# Altium schematic sheet rf_clocks.SchDoc: RF & clocks
size A4; SheetNumber: 11; SheetTotal: 11
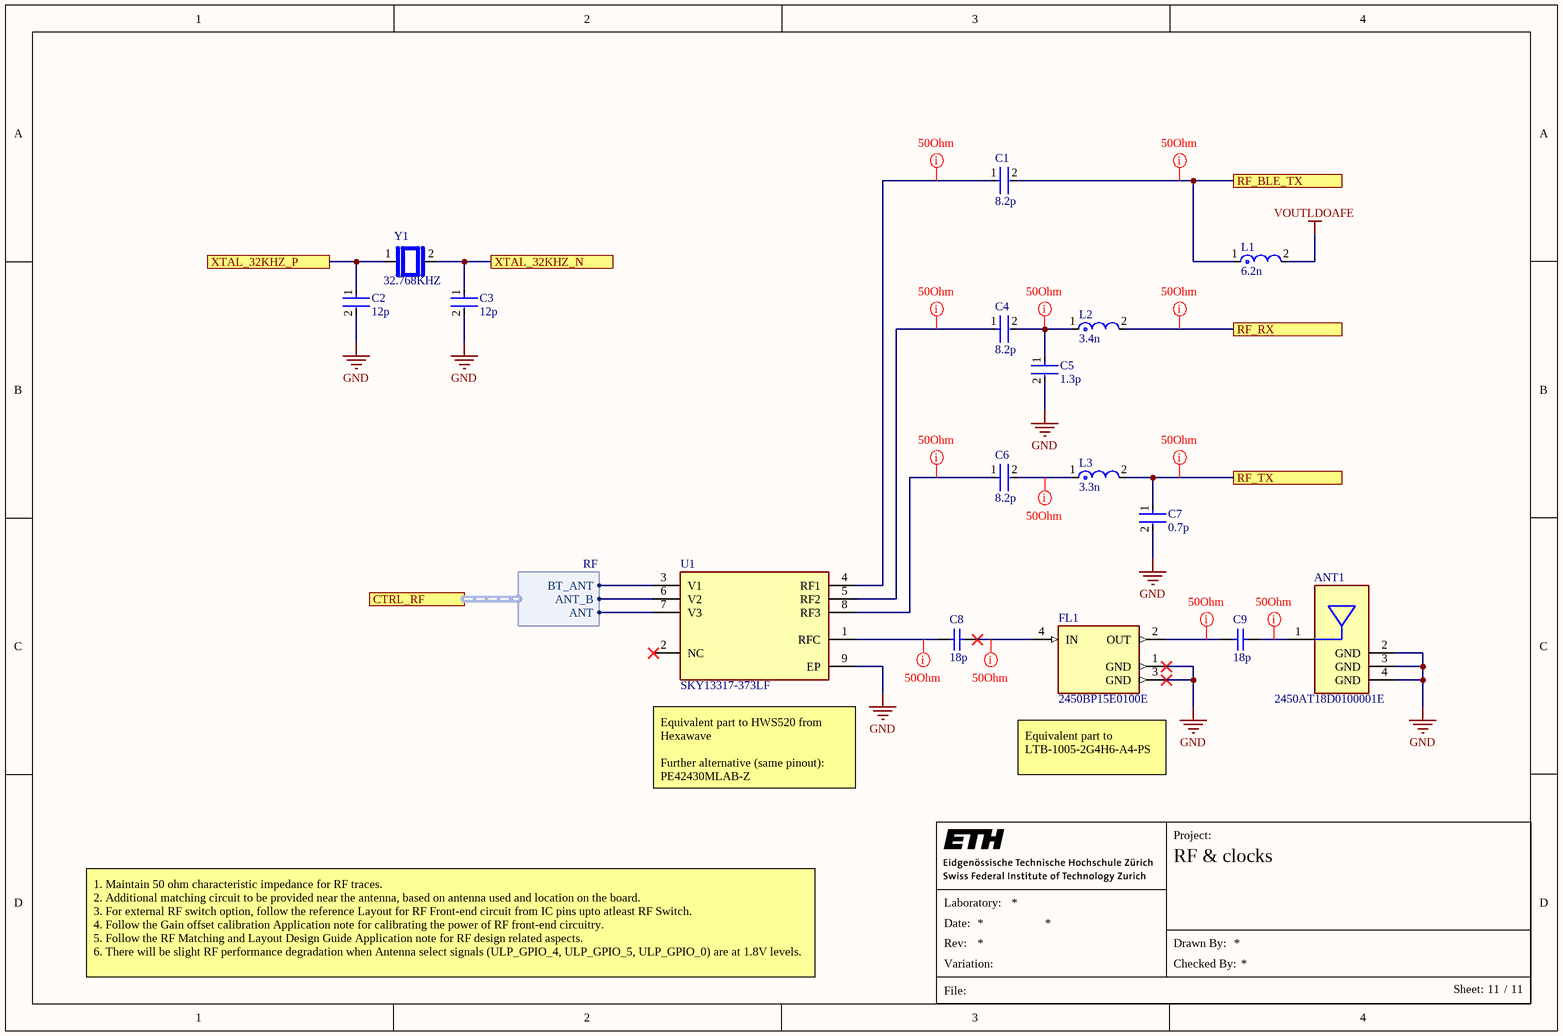
[diagram p0: rf_clocks.SchDoc]

## Parts
ANT1  2450AT18D0100001E  [FP-2450AT18D0100001E-MFG]
C1  8.2p  [FP-GJM155-0_05-IPC_B]
C2  12p  [FP-GRM155-0_05-MFG]
C3  12p  [FP-GRM155-0_05-MFG]
C4  8.2p  [FP-GJM155-0_05-IPC_B]
C5  1.3p  [FP-GJM155-0_05-IPC_B]
C6  8.2p  [FP-GJM155-0_05-IPC_B]
C7  0.7p  [FP-GJM155-0_05-IPC_C]
C8  18p  [CAPC1005X55X25LL05T10]
C9  18p  [CAPC1005X55X25LL05T10]
FL1  2450BP15E0100E  [FIL_2450BP15E0100E]
L1  6.2n  [FP-LQG15WH_02-IPC_C]
L2  3.4n  [FP-LQG15WH_02-IPC_C]
L3  3.3n  [FP-LQG15HH_02-IPC_C]
U1  SKY13317-373LF  [FP-SKY13317-373LF-MFG]
Y1  32.768KHZ  [XTAL_CM8V-T1A-32.768KHZ-7PF-20PPM-TA-QC]

## Ports
CTRL_RF (harness RF, see main[6A], io_b[4B], power_io[6C]), RF_BLE_TX (see main[6A], power_io[2C], power_rf[4C]), RF_RX (see main[6A], power_io[2C], power_rf[4B]), RF_TX (see main[6A], power_io[2C], power_rf[4A]), XTAL_32KHZ_N (see main[6A], power_core[1C], power_io[2B]), XTAL_32KHZ_P (see main[6A], power_core[1C], power_io[2B])

## Harnesses
RF: BT_ANT, ANT, ANT_B

## Nets
GND: ANT1.2(GND) ANT1.3(GND) ANT1.4(GND) C2.2 C3.2 C5.2 C7.2 FL1.1(GND) FL1.3(GND) U1.9(EP)
VOUTLDOAFE: L1.2
RF_BLE_TX: C1.2 L1.1 ; port RF_BLE_TX
RF_RX: L2.2 ; port RF_RX
RF_TX: C7.1 L3.2 ; port RF_TX
XTAL_32KHZ_N: C3.1 Y1.2 ; port XTAL_32KHZ_N
XTAL_32KHZ_P: C2.1 Y1.1 ; port XTAL_32KHZ_P
NetANT1_1: ANT1.1(FEED) C9.2
NetC1_1: C1.1 U1.4(RF1)
NetC4_1: C4.1 U1.5(RF2)
NetC4_2: C4.2 C5.1 L2.1
NetC6_1: C6.1 U1.8(RF3)
NetC6_2: C6.2 L3.1
NetC8_1: C8.1 U1.1(RFC)
NetC8_2: C8.2 FL1.4(IN)
NetC9_1: C9.1 FL1.2(OUT)
NetU1_3: U1.3(V1) ; port CTRL_RF.BT_ANT
NetU1_6: U1.6(V2) ; port CTRL_RF.ANT_B
NetU1_7: U1.7(V3) ; port CTRL_RF.ANT

Not connected (* = marked no-connect by the designer): U1 2(NC)*

## Layout directives
rule Width Constraint [Pref Impedance = 50.00ohms    Min Impedance = 50.00ohms    Max Impedance = 50.00ohms]: NetANT1_1, NetC1_1, NetC4_1, NetC4_2, NetC6_1, NetC6_2, NetC8_1, NetC8_2, NetC9_1, RF_BLE_TX, RF_RX, RF_TX

## Notes on the sheet
- (near U1) Equivalent part to HWS520 from Hexawave
  Further alternative (same pinout): PE42430MLAB-Z
- (near FL1) Equivalent part to LTB-1005-2G4H6-A4-PS
- 1. Maintain 50 ohm characteristic impedance for RF traces.
  2. Additional matching circuit to be provided near the antenna, based on antenna used and location on the board.
  3. For external RF switch option, follow the reference Layout for RF Front-end circuit from IC pins upto atleast RF Switch.
  4. Follow the Gain offset calibration Application note for calibrating the power of RF front-end circuitry.
  5. Follow the RF Matching and Layout Design Guide Application note for RF design related aspects.
  6. There will be slight RF performance degradation when Antenna select signals (ULP_GPIO_4, ULP_GPIO_5, ULP_GPIO_0) are at 1.8V levels.
- Project:
- Laboratory:
- Date:
- File:
- Rev:
- Variation:
- Drawn By:
- Checked By:
- Sheet:
- /

## Library data of the parts
ANT1 = CMP-00849-135603252-1: 2450AT18D0100001E 2.4 Ghz SMD Antenna Resiliant; Bandwidth: 100MHz; Impedance: 50Ω; Power Rating: 3W; Number of Bands: 1; Max Frequency: 2.5GHz; Return Loss: 10dB; Gain: -1dB; Min Operating Temperature: -40°C; Height: 1.3mm; Case/Package: 1206; NexarPartId: 135603252; Max Operating Temperature: 125°C
C1 C4 C6 = CMP-2008-03885-2: Multi-Layer Ceramic Capacitor 8.2pF C0G  ±0.1pF 0402 Paper T/R; Voltage Rating: 50V; Case Code (Imperial): 0402; Length: 1mm; Width: 0.02inch; Dielectric: C0G; Mount: Surface Mount; Case Code (Metric): 1005; Max Operating Temperature: 125°C; Thickness: 0.022inch; Lead Free: Lead Free; Package Quantity: 10000; Case/Package: 0402; Voltage Rating (DC): 50V; Termination: SMD/SMT; Height: 0.5mm; Capacitance: 8.2pF; Min Operating Temperature: -55°C; Radiation Hardening: No; Packaging: Tape and Reel; Depth: 0.5mm
C2 C3 = CMP-2008-03945-2: CAP CER 12PF 50V C0G/NP0 0402; Tolerance: 2%; Dielectric: C0G; Material: Ceramic; Termination: SMD/SMT; Mount: Surface Mount; REACH SVHC: No SVHC; Depth: 0.5mm; Case Code (Metric): 1005; Voltage Rating: 50V; Height: 0.5mm; Voltage Rating (DC): 50V; Case Code (Imperial): 0402; Package Quantity: 10000; Construction: Flat; Thickness: 0.022inch; Length: 1mm; Min Operating Temperature: -55°C; Width: 0.5mm; Lead Free: Lead Free; Capacitance: 12pF; Case/Package: 0402; Packaging: Tape and Reel; Series: GRM; Voltage: 50V; Radiation Hardening: No; Max Operating Temperature: 125°C
C5 = CMP-2008-03818-2: Multi-Layer Ceramic Capacitor 1.3pF C0G  ±0.05pF 0402 Paper T/R; Voltage Rating (DC): 50V; Radiation Hardening: No; Voltage Rating: 50V; Thickness: 0.022inch; Case Code (Metric): 1005; Packaging: Tape and Reel; Dielectric: C0G; Case Code (Imperial): 0402; Lead Free: Lead Free; Depth: 0.5mm; Termination: SMD/SMT; Case/Package: 0402; Min Operating Temperature: -55°C; Height: 0.5mm; Max Operating Temperature: 125°C; Capacitance: 1.3pF; Package Quantity: 10000; Width: 0.02inch; Length: 0.039inch; Mount: Surface Mount
C7 = CMP-2008-03909-2: Multi-Layer Ceramic Capacitor 0.7pF C0G  ±0.05pF 0402 Paper T/R; Voltage Rating (DC): 50V; Packaging: Tape and Reel; Case Code (Imperial): 0402; Mount: Surface Mount; Case Code (Metric): 1005; Width: 0.02inch; Length: 1mm; Radiation Hardening: No; Max Operating Temperature: 125°C; Termination: SMD/SMT; Dielectric: C0G; Min Operating Temperature: -55°C; Height: 0.5mm; Capacitance: 0.7pF; Voltage Rating: 50V; Thickness: 0.022inch; Package Quantity: 10000; Depth: 0.5mm; Case/Package: 0402
C8 C9 = CMP-2008-04271-1: Manufacturer: Murata; Part Number: GRM1555C1H180GA01D
FL1 = 2450BP15E0100E: Ceramic Filters Band Pass 1.5dB 50Ohm SMD 4Pin T/R; MF: {'manufacturer': u'Johanson Technology'}; Package: None; Price: None; Value: *; MP: 2450BP15E0100E; Availability: Unavailable; Supplier 1: Digikey; Supplier Part Number 1: 712-2450BP15E0100001ECT-ND; Supplier 2: Farnell; Supplier Part Number 2: 2148528
L1 = CMP-06042-015013-1: Multilayer type Inductor for Automotive 6.2nH ±0.1nH 0.13Ω 700mA 0402
L2 = CMP-06042-011399-1: Multilayer type Inductor for Automotive 3.4nH ±0.1nH 0.09Ω 900mA 0402
L3 = CMP-06042-003843-1: Multilayer type RF Inductor 3.3nH ±0.3nH 0.12Ω 800mA 0402; DC Resistance (DCR): 190mR; Test Frequency: 100MHz; Core Material: Air; Current Rating: 300mA; Q Factor: 8; Self Resonant Frequency: 6GHz; Shielding: Unshielded; Termination: SMD/SMT; Case Code (Metric): 1005; Lead Free: Lead Free; Min Operating Temperature: -55°C; Radiation Hardening: No; Max Operating Temperature: 125°C; Mount: Surface Mount; Packaging: Tape and Reel; Length: 0.039inch; Case/Package: 0402; Depth: 0.55mm; Inductance: 3.3nH; REACH SVHC: No SVHC; Package Quantity: 10000; Current: 300mA; Height - Seated (Max): 0.022inch; Width: 0.02inch; DC Current: 300mA; Military Standard: Not; Max DC Current: 300mA; Case Code (Imperial): 0402; Height: 0.5mm
U1 = CMP-85923-000011-1: IC RF SWITCH SP3T 6GHZ 8MLP; Test Frequency: 5.9GHz; Number of Switches: 1; Turn-Off Delay Time: 20ns; IIP3: 50dBm; P1dB: 26dBm; Turn-On Delay Time: 55ns; Operating Frequency: 20 MHz to 6 GHz; Insertion Loss: 0.8dB; Impedance: 50R; Min Operating Temperature: -40°C; Max Operating Temperature: 100°C; Number of Pins: 8; Max Frequency: 6GHz; Mount: Surface Mount; Case/Package: QFN; Radiation Hardening: No; Frequency: 6GHz; Package Quantity: 3000; Throw Configuration: SP3T; RoHS Compliant: Yes; Series: -; Packaging: Tape and Reel; Technology: GAAS
Y1 = CM8V-T1A-32.768KHZ-7PF-20PPM-TA-QC: MF: {'manufacturer': u'Micro Crystal'}; Package: None; Price: None; Value: *; MP: CM8V-T1A-32.768KHZ-7PF-20PPM-TA-QC; Availability: Unavailable; Supplier 1: Arrow Electronics; Supplier Part Number 1: CM8V-T1A-32.768KHZ-7PF-20PPM-TA-QC